# EAGLE design otherblink (EAGLE 6.6.0)
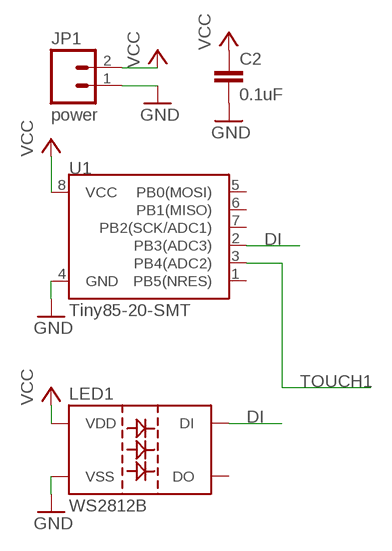
[diagram p0: schematic, sheet 1]

## Parts
C2  0.1uF  0.1UF-25V-5%(0603)  [0603-CAP]
JP1  power  M02PTH3  [1X02_LONGPADS]
LED1  WS2812B  [WS2812B]
U1  Tiny85-20-SMT  ATTINY45TINY85-20-SMT  [SO08-EIAJ]

## Nets
DI: LED1.4(DI) U1.2(PB3(ADC3))
GND: C2.2 JP1.1 LED1.3(VSS) U1.4(GND)
TOUCH1: U1.3(PB4(ADC2))
VCC: C2.1 JP1.2 LED1.1(VDD) U1.8(VCC)
Unconnected: LED1.2(DO) U1.1(PB5(NRES)) U1.5(PB0(MOSI)) U1.6(PB1(MISO)) U1.7(PB2(SCK/ADC1))

## Library data of the parts
C2 = SparkFun-Capacitors:0.1UF-25V-5%(0603): CAP-08604; PROD_ID: CAP-08604
JP1 = SparkFun-Connectors:M02: Standard 2-pin 0.1" header. Use with - straight break away headers ( PRT-00116) - right angle break away headers (PRT-00553) - swiss pins (PRT-00743) - machine pins (PRT-00117) - female headers (PRT-00115) Molex polarized connector foot print use with: PRT-08233 with associated crimp pins and housings. 2.54_SCREWTERM for use with PRT-10571. 3.5mm Screw Terminal footprints for PRT-08084 5mm Screw Terminal footprints for use with PRT-08433
LED1 = WS2812:WS2812B
U1 = SparkFun-DigitalIC:ATTINY45: Atmel 8-pin 2/4/8kB flash uC; PROD_ID: IC-09092

## Board
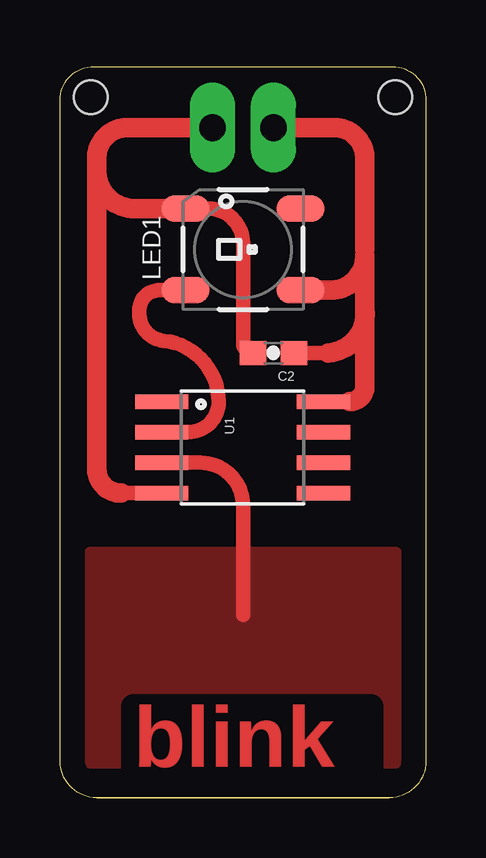
[diagram p1: board, top side]

Size 15.25 x 30.49 mm. Coordinates in mm from the lower left corner, seen from the top.
Outline: 1.53,0 13.72,0
Outline: 1.53,0 arc-90 0.01,1.52 0.01,28.96 arc-90 1.28,30.48 13.72,30.48 arc-90 15.25,29.21 15.25,1.52 arc-90 13.72,0
Outline: 13.72,0 1.53,0
Copper layers (1*16): Top 0.035mm / dielectric 1.5mm / Bottom 0.035mm
Design rules "othermill": minimum track width 10mil, minimum drill 24mil, track to track 20mil, track to pad 20mil, pad to pad 20mil, via to via 20mil, smd to smd 20mil, copper to edge 40mil, drill to drill 8mil, minimum pad ring 10mil, minimum via ring 8mil, stop-mask expansion 4mil, vias tented up to drill 0mil, thermal gap 10mil
Holes 1.4 mm at 1.28,29.21 13.98,29.21

### Footprints (pad centres in the part's own frame; a part is rotated, then mirrored left to right if it is on the bottom)
0603-CAP = smd 1.1 x 1: 1 -0.85,0; 2 0.85,0
1X02_LONGPADS = drill 1.118 pad 1.88 long: 1 0,0; 2 2.54,0
WS2812B = smd 2 x 1.1: 1 2.4,-1.7; 2 2.4,1.7; 3 -2.4,1.7; 4 -2.4,-1.7
SO08-EIAJ = smd 0.61 x 2.21: 1 -1.905,-3.378; 2 -0.635,-3.378; 3 0.635,-3.378; 4 1.905,-3.378; 5 1.905,3.353; 6 0.635,3.353; 7 -0.635,3.353; 8 -1.905,3.353

### Placement (x,y rotation side)
C2  8.9,18.54 180 top
JP1  6.36,27.94 0 top
LED1  7.63,22.86 0 top
U1  7.63,14.61 270 top

### Tracks (layer width: path | path; a pad name or v marks a point on that pad's centre or on a via)
DI
  Top 0.406: 5.43,20.95 arc-90 LED1.4
  Top 0.61: U1.2 5.34,15.24 arc90 6.61,16.51 arc84 4.32,19.05 arc-90 3.31,20.32 arc-90 4.15,21.16 LED1.4
GND
  Top 0.61: 2.55,12.7 U1.4 | LED1.3 6.18,24.56 arc-90 7.63,23.11 7.63,18.96 arc90 C2.2
  Top 0.813: JP1.1 2.8,27.94 arc90 1.53,26.67 1.53,26.16 | 1.53,26.16 1.53,13.72 arc90 2.55,12.7 | LED1.3 3.13,24.56 arc-90 1.53,26.16
TOUCH1
  Top 0.61: U1.3 5.85,13.97 arc-90 7.63,12.19 7.63,11.18 7.63,7.62
  pour Top: 13.98,10.16 1.28,10.16 1.28,1.52 13.98,1.52
VCC
  Top 0.406: 12.71,22.61 12.71,22.86 12.71,22.61 | 12.71,22.61 12.71,21.16 | 12.07,16.51 U1.8 | LED1.1 10.37,21.16 | C2.1 10.17,18.54
  Top 0.61: 10.17,18.54 11.18,18.54
  Top 0.813: JP1.2 11.44,27.94 arc-90 12.71,26.67 12.71,23.5 12.71,22.86 | 12.71,20.32 12.71,22.61 arc-90 11.26,21.16 10.37,21.16 | 12.71,20.32 12.71,19.68 12.71,17.14 arc-90 12.07,16.51 | 11.18,18.54 arc90 12.71,20.32

### Text on the board
Top: blink